# EAGLE design single_asic_miner (EAGLE 6.3)
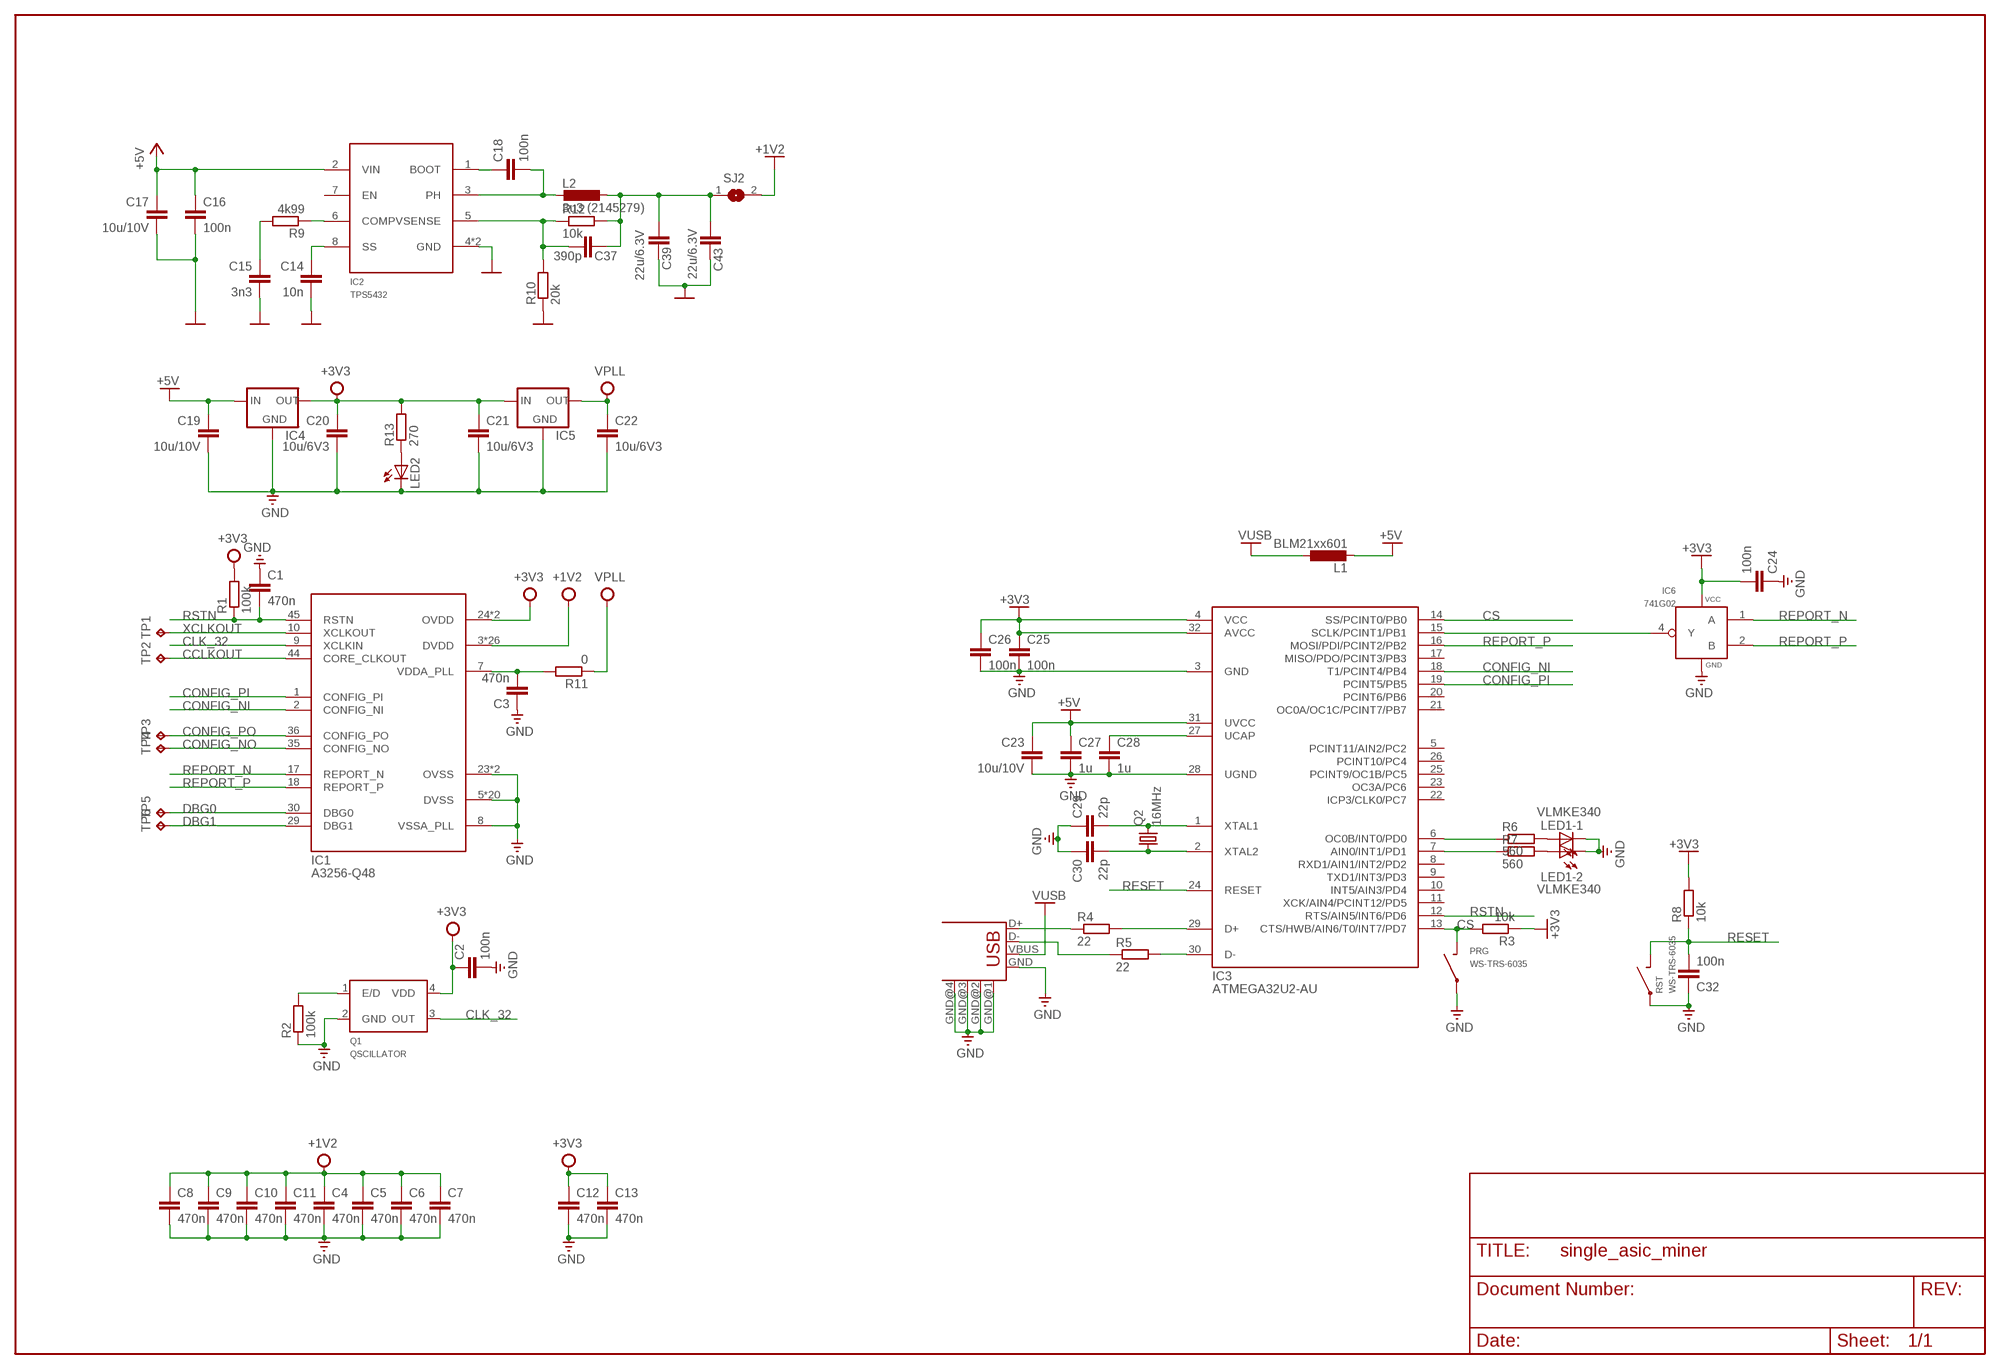
[diagram p0: schematic, sheet 1]

## Parts
C1  470n  C-EUC0805  [C0805]
C2  100n  C-EUC0805  [C0805]
C3  470n  C-EUC0805  [C0805]
C4  470n  C-EUC0805  [C0805]
C5  470n  C-EUC0805  [C0805]
C6  470n  C-EUC0805  [C0805]
C7  470n  C-EUC0805  [C0805]
C8  470n  C-EUC0805  [C0805]
C9  470n  C-EUC0805  [C0805]
C10  470n  C-EUC0805  [C0805]
C11  470n  C-EUC0805  [C0805]
C12  470n  C-EUC0805  [C0805]
C13  470n  C-EUC0805  [C0805]
C14  10n  C-EUC0805  [C0805]
C15  3n3  C-EUC0805  [C0805]
C16  100n  C-EUC0805  [C0805]
C17  10u/10V  C-EUC0805  [C0805]
C18  100n  C-EUC0805  [C0805]
C19  10u/10V  C-EUC0805  [C0805]
C20  10u/6V3  C-EUC0805  [C0805]
C21  10u/6V3  C-EUC0805  [C0805]
C22  10u/6V3  C-EUC0805  [C0805]
C23  10u/10V  C-EUC0805  [C0805]
C24  100n  C-EUC0805  [C0805]
C25  100n  C-EUC0805  [C0805]
C26  100n  C-EUC0805  [C0805]
C27  1u  C-EUC0805  [C0805]
C28  1u  C-EUC0805  [C0805]
C29  22p  C-EUC0805  [C0805]
C30  22p  C-EUC0805  [C0805]
C32  100n  C-EUC0805  [C0805]
C37  390p  C-EUC0805  [C0805]
C39  22u/6.3V  C-EUC0805  [C0805]
C43  22u/6.3V  C-EUC0805  [C0805]
IC1  A3256-Q48  [QFN48]
IC2  TPS5432  [SO08E]
IC3  ATMEGA32U2-AU  [TQFP32]
IC4  LM1117  [SOT223]
IC5  LM1117  [SOT223]
IC6  741G02  [SOT23-5]
L1  BLM21xx601  L-EUL0805  [L0805]
L2  3u3 (2145279)  L-4540  [L4540]
LED1  VLMKE340  VLMKE3400  [PLCC4]
LED2  LEDCHIP-LED0805  [CHIP-LED0805]
PRG  WS-TRS-6035  [WS-TRS]
Q1  QSCILLATOR  [SMD7552]
Q2  16MHz  CRYSTAL-ABM7  [6035]
R1  100k  R-EU_R0805  [R0805]
R2  100k  R-EU_R0805  [R0805]
R3  10k  R-EU_R0805  [R0805]
R4  22  R-EU_R0805  [R0805]
R5  22  R-EU_R0805  [R0805]
R6  560  R-EU_R0805  [R0805]
R7  560  R-EU_R0805  [R0805]
R8  10k  R-EU_R0805  [R0805]
R9  4k99  R-EU_R0805  [R0805]
R10  20k  R-EU_R0805  [R0805]
R11  0  R-EU_R0805  [R0805]
R12  10k  R-EU_R0805  [R0805]
R13  270  R-EU_R0805  [R0805]
RST  WS-TRS-6035  [WS-TRS]
SJ2  SJ  [SJ]
TP1  TPB1,27  [B1,27]
TP2  TPB1,27  [B1,27]
TP3  TPB1,27  [B1,27]
TP4  TPB1,27  [B1,27]
TP5  TPB1,27  [B1,27]
TP6  TPB1,27  [B1,27]
X1  USB-SHIELD-1  [USB-M-S1_1]

## Nets
+1V2: C4.1 C5.1 C6.1 C7.1 C8.1 C9.1 C10.1 C11.1 IC1.3(DVDD) IC1.4(DVDD) IC1.6(DVDD) IC1.11(DVDD) IC1.12(DVDD) IC1.13(DVDD) IC1.14(DVDD) IC1.15(DVDD) IC1.16(DVDD) IC1.19(DVDD) IC1.21(DVDD) IC1.22(DVDD) IC1.25(DVDD) IC1.26(DVDD) IC1.27(DVDD) IC1.28(DVDD) IC1.31(DVDD) IC1.33(DVDD) IC1.34(DVDD) IC1.39(DVDD) IC1.40(DVDD) IC1.41(DVDD) IC1.43(DVDD) IC1.46(DVDD) IC1.47(DVDD) IC1.48(DVDD) SJ2.2
+3V3: C2.1 C12.1 C13.1 C20.1 C21.1 C24.2 C25.1 C26.1 IC1.24(OVDD) IC1.37(OVDD) IC3.4(VCC) IC3.32(AVCC) IC4.2(OUT) IC5.3(IN) IC6.5(VCC) Q1.4(VDD) R1.2 R3.1 R8.2 R13.2
+5V: C16.1 C17.1 C19.1 C23.1 C27.1 IC2.2(VIN) IC3.31(UVCC) IC4.3(IN) L1.2
CCLKOUT: IC1.44(CORE_CLKOUT) TP2.TP
CLK_32: IC1.9(XCLKIN) Q1.3(OUT)
CONFIG_NI: IC1.2(CONFIG_NI) IC3.18(T1/PCINT4/PB4)
CONFIG_NO: IC1.35(CONFIG_NO) TP4.TP
CONFIG_PI: IC1.1(CONFIG_PI) IC3.19(PCINT5/PB5)
CONFIG_PO: IC1.36(CONFIG_PO) TP3.TP
CS: IC3.13(CTS/HWB/AIN6/T0/INT7/PD7) IC3.14(SS/PCINT0/PB0) PRG.P$2 R3.2
D+: IC3.29(D+) R4.2
D-: IC3.30(D-) R5.2
DBG0: IC1.30(DBG0) TP5.TP
DBG1: IC1.29(DBG1) TP6.TP
GND: C1.1 C2.2 C3.1 C4.2 C5.2 C6.2 C7.2 C8.2 C9.2 C10.2 C11.2 C12.2 C13.2 C14.2 C15.2 C16.2 C17.2 C19.2 C20.2 C21.2 C22.2 C23.2 C24.1 C25.2 C26.2 C27.2 C28.2 C29.1 C30.1 C32.1 C39.2 C43.2 IC1.5(DVSS) IC1.8(VSSA_PLL) IC1.20(DVSS) IC1.23(OVSS) IC1.32(DVSS) IC1.38(OVSS) IC1.42(DVSS) IC1.P$1(DVSS) IC1.P$2(DVSS) IC1.P$3(DVSS) IC1.P$4(DVSS) IC1.P$5(DVSS) IC1.P$6(DVSS) IC1.P$7(DVSS) IC1.P$8(DVSS) IC1.P$9(DVSS) IC1.P$10(DVSS) IC1.P$11(DVSS) IC1.P$12(DVSS) IC1.P$13(DVSS) IC1.P$14(DVSS) IC1.P$15(DVSS) IC1.P$16(DVSS) IC2.4(GND) IC2.E(GND) IC3.3(GND) IC3.28(UGND) IC4.1(GND) IC5.1(GND) IC6.3(GND) LED1.C1(-1:C) LED1.C2(-2:C) LED2.C PRG.P$1 Q1.2(GND) R2.1 R10.1 RST.P$1 X1.GND X1.GND@1(GND) X1.GND@2(GND) X1.GND@3(GND) X1.GND@4(GND)
N$1: IC3.15(SCLK/PCINT1/PB1) IC6.4(Y)
N$2: Q1.1(E/D) R2.2
N$3: IC3.6(OC0B/INT0/PD0) R6.1
N$4: IC3.7(AIN0/INT1/PD1) R7.1
N$5: LED1.A1(-1:A) R6.2
N$6: LED1.A2(-2:A) R7.2
N$7: C3.2 IC1.7(VDDA_PLL) R11.2
N$8: R4.1 X1.D+
N$9: R5.1 X1.D-
N$10: C28.1 IC3.27(UCAP)
N$11: LED2.A R13.1
N$13: C29.2 IC3.1(XTAL1) Q2.P$2
N$14: C30.2 IC3.2(XTAL2) Q2.P$1
N$23: C14.1 IC2.8(SS)
N$24: IC2.6(COMP) R9.1
N$25: C15.1 R9.2
N$26: C18.1 IC2.1(BOOT)
N$27: C18.2 IC2.3(PH) L2.P$2
N$28: C37.1 C39.1 C43.1 L2.P$1 R12.2 SJ2.1
N$29: C37.2 IC2.5(VSENSE) R10.2 R12.1
REPORT_N: IC1.17(REPORT_N) IC6.1(A)
REPORT_P: IC1.18(REPORT_P) IC3.16(MOSI/PDI/PCINT2/PB2) IC6.2(B)
RESET: C32.2 IC3.24(RESET) R8.1 RST.P$2
RSTN: C1.2 IC1.45(RSTN) IC3.12(RTS/AIN5/INT6/PD6) R1.1
VPLL: C22.1 IC5.2(OUT) R11.1
VUSB: L1.1 X1.VBUS
XCLKOUT: IC1.10(XCLKOUT) TP1.TP
Unconnected: IC2.7(EN) IC3.5(PCINT11/AIN2/PC2) IC3.8(RXD1/AIN1/INT2/PD2) IC3.9(TXD1/INT3/PD3) IC3.10(INT5/AIN3/PD4) IC3.11(XCK/AIN4/PCINT12/PD5) IC3.17(MISO/PDO/PCINT3/PB3) IC3.20(PCINT6/PB6) IC3.21(OC0A/OC1C/PCINT7/PB7) IC3.22(ICP3/CLK0/PC7) IC3.23(OC3A/PC6) IC3.25(PCINT9/OC1B/PC5) IC3.26(PCINT10/PC4)

## Library data of the parts
C1-C30 C32 C37 C39 C43 = rcl:C-EU: CAPACITOR, European symbol
IC1 = mystuff:A3256
IC2 = mystuff:TPS5432
IC3 = mystuff:ATMEGA32U2
IC4 IC5 = v-reg-2:LM1117
IC6 = mystuff:74*1G02
L1 = rcl:L-EU: INDUCTOR, European symbol
L2 = mystuff:L-
LED1 = mystuff:VLMKE340
LED2 = led:LED: LED OSRAM: - CHIPLED LG R971, LG N971, LY N971, LG Q971, LY Q971, LO R971, LY R971 LH N974, LH R974 LS Q976, LO Q976, LY Q976 LO Q996 - Hyper CHIPLED LW Q18S LB Q993, LB Q99A, LB R99A - SideLED LS A670, LO A670, LY A670, LG A670, LP A670 LB A673, LV A673, LT A673, LW A673 LH A674 LY A675 LS A676, LA A676, LO A676, LY A676, LW A676 LS A679, LY A679, LG A679 - Hyper Micro SIDELED® LS Y876, LA Y876, LO Y876, LY Y876 LT Y87S - SmartLED LW L88C, LW L88S LB L89C, LB L89S, LG L890 LS L89K, LO L89K, LY L89K LS L896, LA L896, LO L896, LY L896 - TOPLED LS T670, LO T670, LY T670, LG T670, LP T670 LSG T670, LSP T670, LSY T670, LOP T670, LYG T670 LG T671, LOG T671, LSG T671 LB T673, LV T673, LT T673, LW T673 LH T674 LS T676, LA T676, LO T676, LY T676, LB T676, LH T676, LSB T676, LW T676 LB T67C, LV T67C, LT T67C, LS T67K, LO T67K, LY T67K, LW E67C LS E67B, LA E67B, LO E67B, LY E67B, LB E67C, LV E67C, LT E67C LW T67C LS T679, LY T679, LG T679 LS T770, LO T770, LY T770, LG T770, LP T770 LB T773, LV T773, LT T773, LW T773 LH T774 LS E675, LA E675, LY E675, LS T675 LS T776, LA T776, LO T776, LY T776, LB T776 LHGB T686 LT T68C, LB T68C - Hyper Mini TOPLED® LB M676 - Mini TOPLED Santana® LG M470 LS M47K, LO M47K, LY M47K Source: http://www.osram.convergy.de LUXEON: - LUMILED® LXK2-PW12-R00, LXK2-PW12-S00, LXK2-PW14-U00, LXK2-PW14-V00 LXK2-PM12-R00, LXK2-PM12-S00, LXK2-PM14-U00 LXK2-PE12-Q00, LXK2-PE12-R00, LXK2-PE12-S00, LXK2-PE14-T00, LXK2-PE14-U00 LXK2-PB12-K00, LXK2-PB12-L00, LXK2-PB12-M00, LXK2-PB14-N00, LXK2-PB14-P00, LXK2-PB14-Q00 LXK2-PR12-L00, LXK2-PR12-M00, LXK2-PR14-Q00, LXK2-PR14-R00 LXK2-PD12-Q00, LXK2-PD12-R00, LXK2-PD12-S00 LXK2-PH12-R00, LXK2-PH12-S00 LXK2-PL12-P00, LXK2-PL12-Q00, LXK2-PL12-R00 Source: www.luxeon.com KINGBRIGHT: KA-3528ASYC Source: www.kingbright.com
PRG RST = mystuff:WS-TRS-6035
Q1 = mystuff:QSCILLATOR: Oscillators FOX Electronics FXO-HC736R-25
Q2 = mystuff:CRYSTAL-ABM7
R1-R13 = rcl:R-EU_: RESISTOR, European symbol
SJ2 = jumper:SJ: SMD solder JUMPER
TP1-TP6 = testpad:TP: Test pad
X1 = con-usb-2:USB-SHIELD

## Board
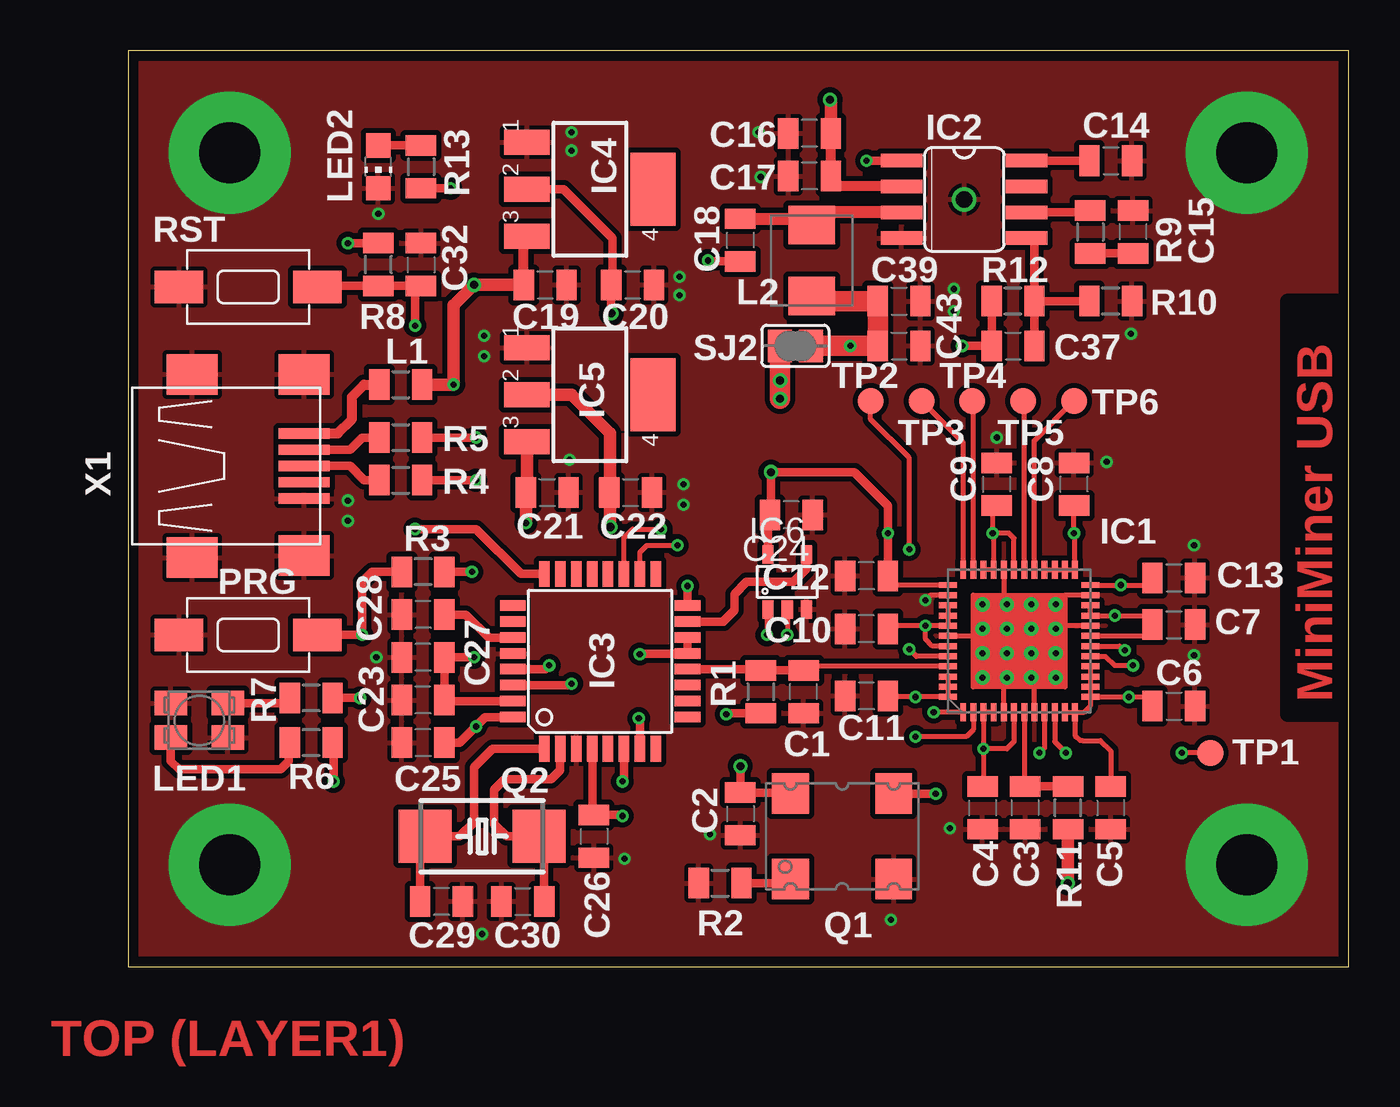
[diagram p1: board, top side]
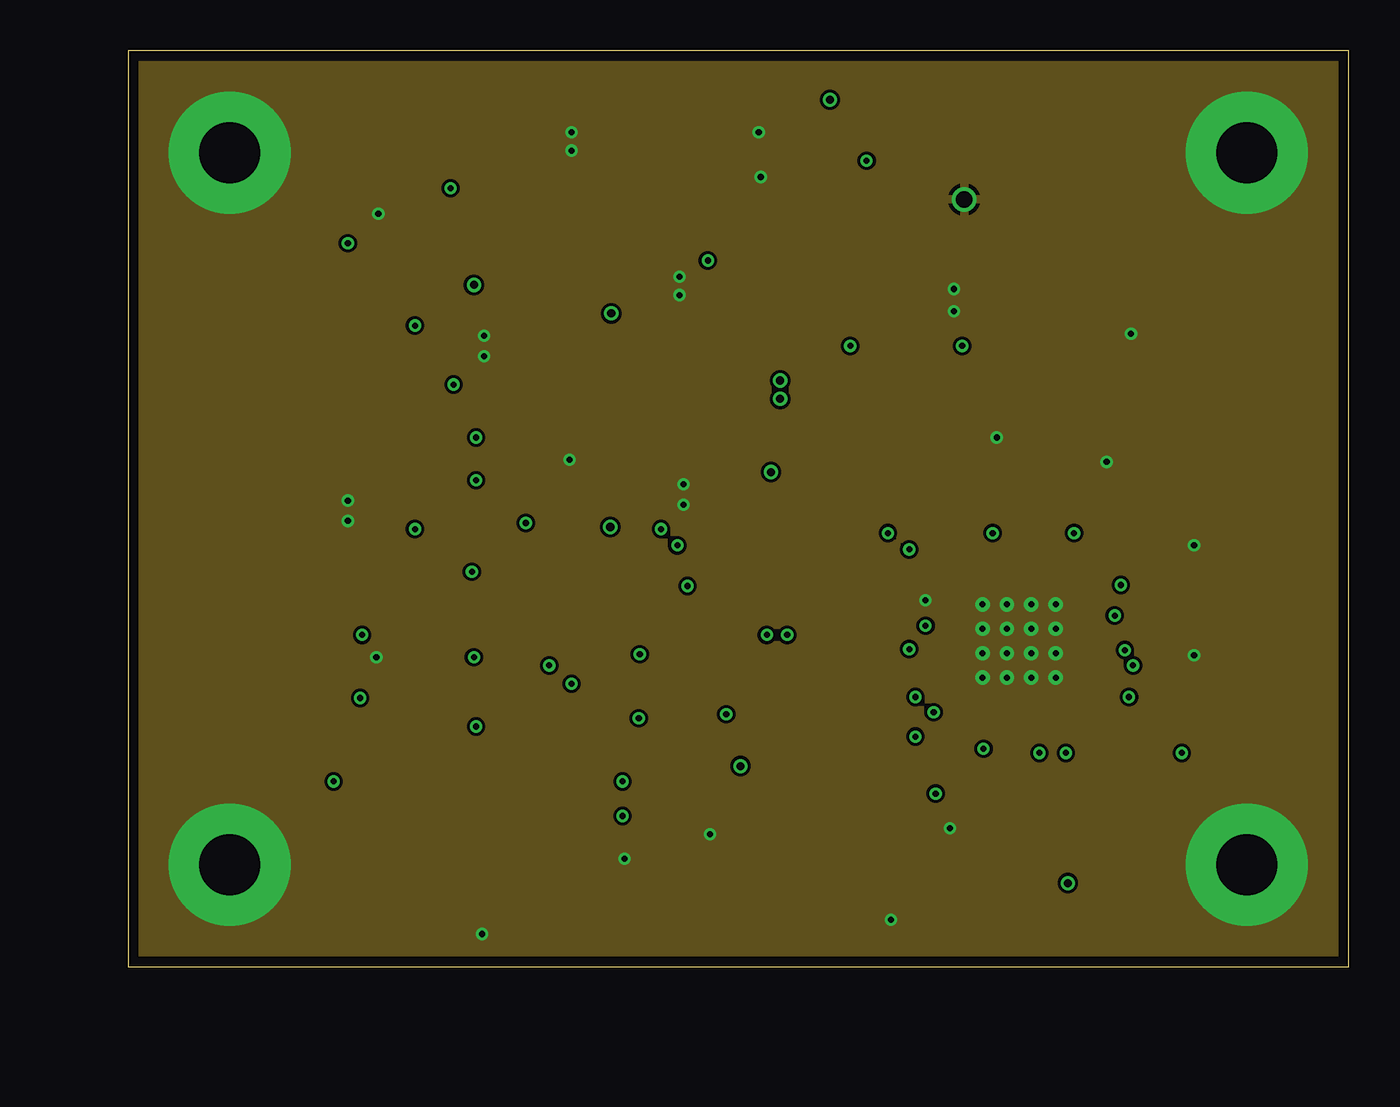
[diagram p2: board, inner layer Route2]
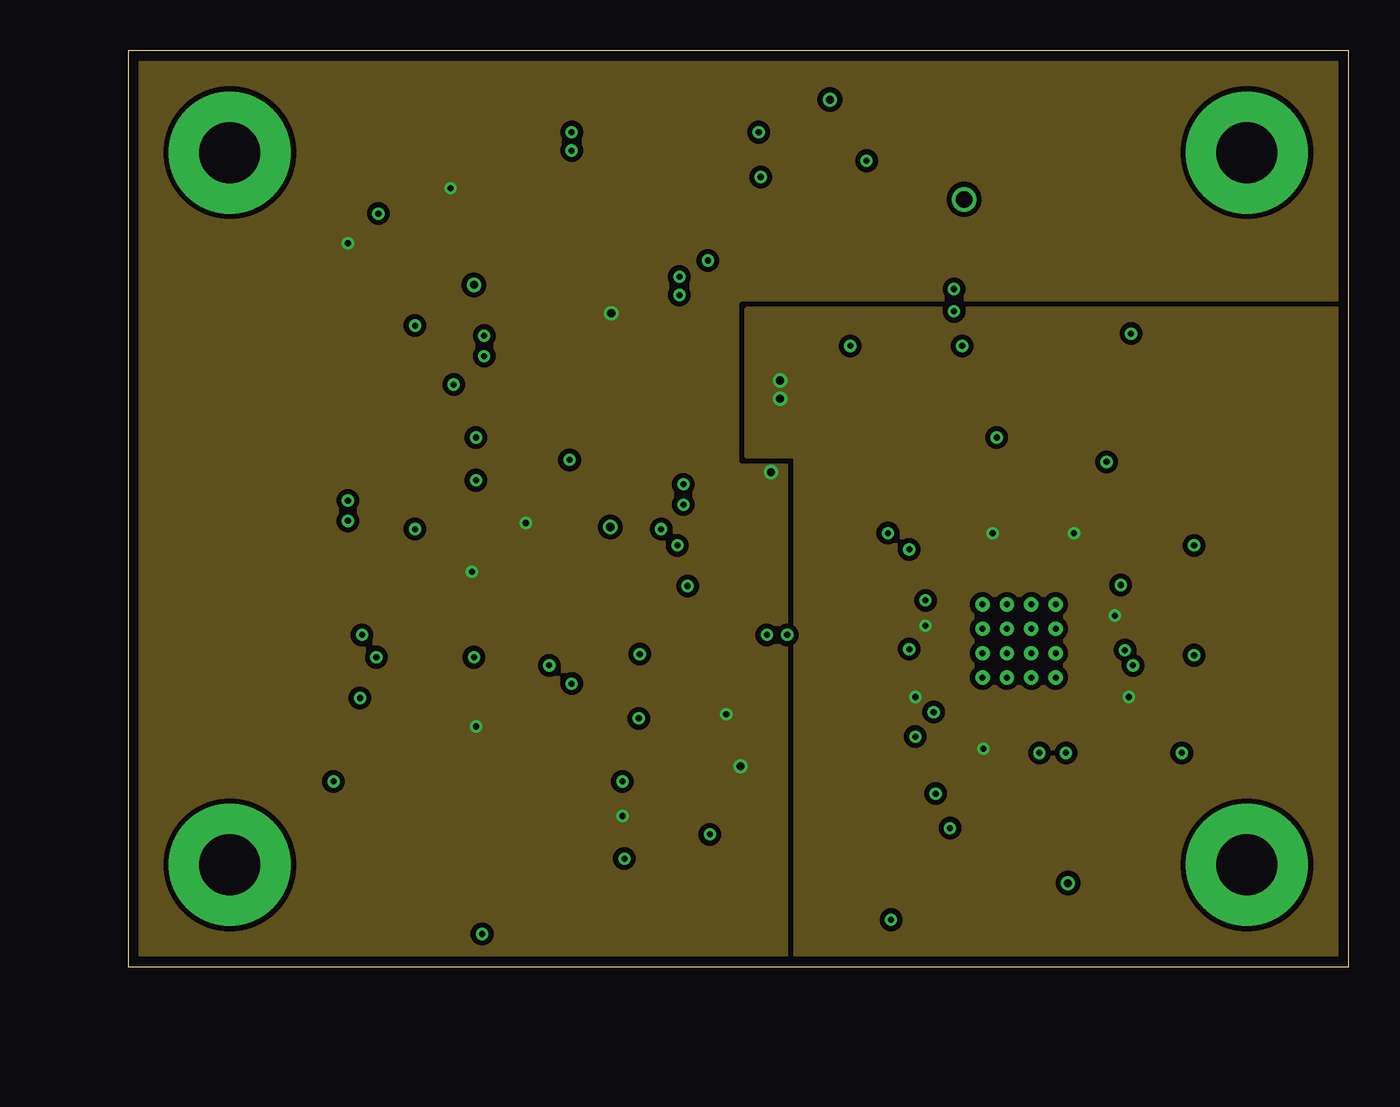
[diagram p3: board, inner layer Route15]
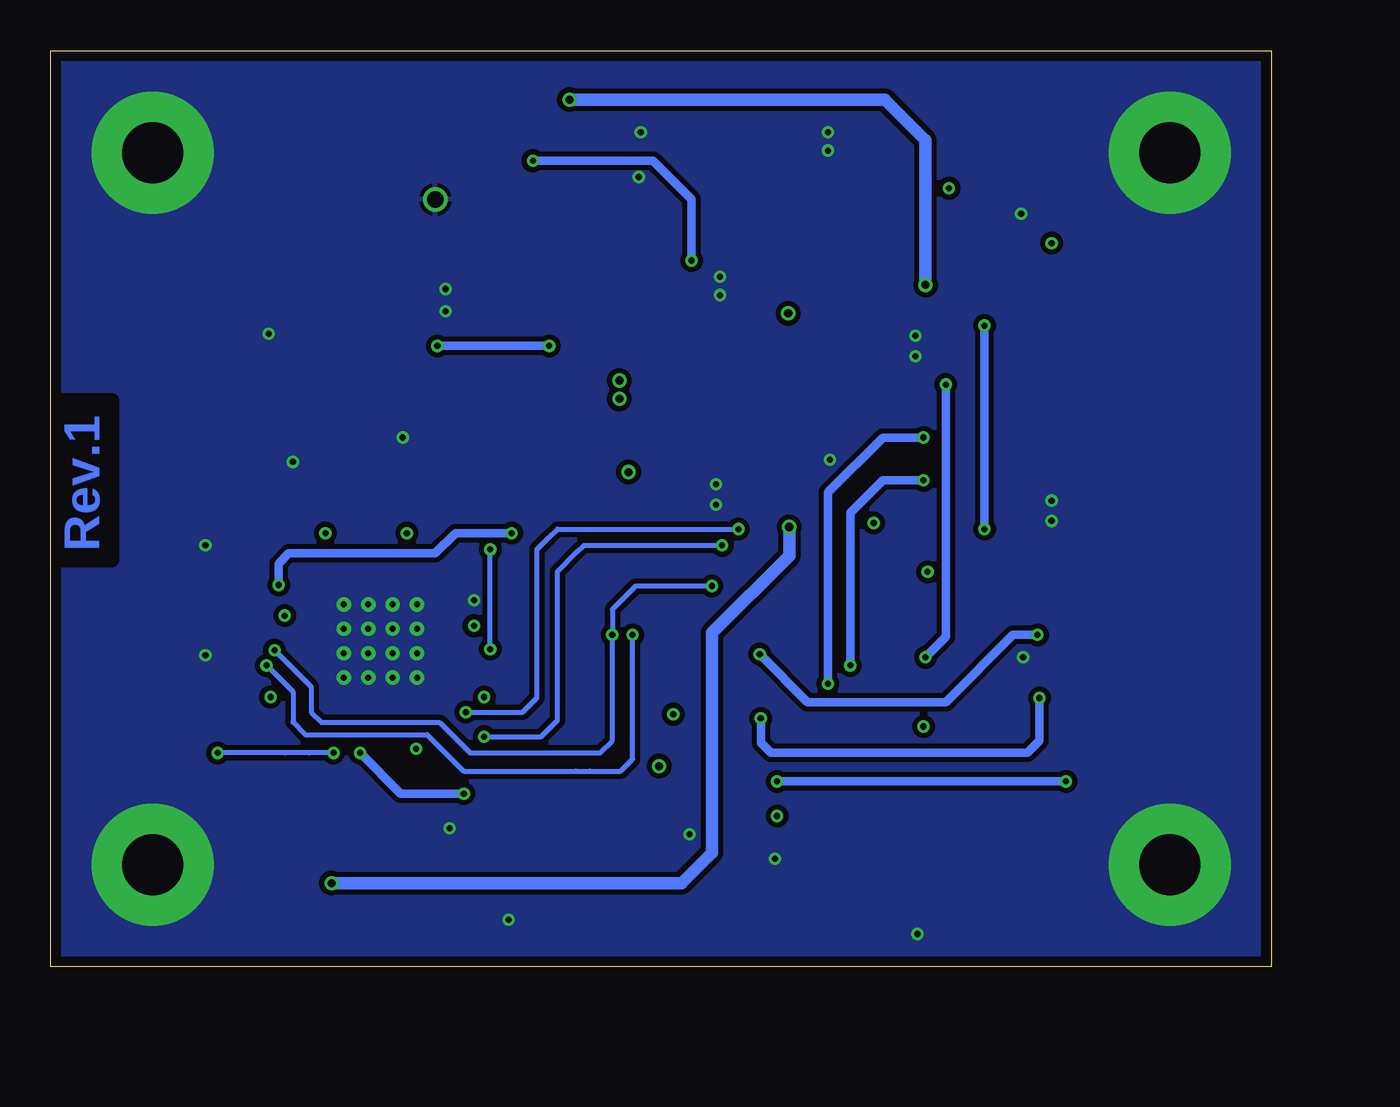
[diagram p4: board, bottom side, seen from below]

Size 60 x 45 mm. Coordinates in mm from the lower left corner, seen from the top.
Outline: 0,0 60,0 60,45 0,45 0,0
Copper layers (1+(2*15)+16): Top 0.035mm / dielectric 0.4mm / Route2 0.035mm / dielectric 0.7mm / Route15 0.035mm / dielectric 0.4mm / Bottom 0.035mm
Design rules "my_multi-cb_035um-cu *": minimum track width 0.15mm, minimum drill 0.3mm, track to track 0.15mm, track to pad 0.15mm, pad to pad 0.15mm, via to via 0.15mm, smd to smd 0.125mm, copper to edge 20mil, drill to drill 8mil, minimum pad ring 8mil, minimum via ring 0.15mm, stop-mask expansion 3mil, vias tented up to drill 0.2mm, thermal gap 8mil
tRestrict: 12 lines
bRestrict: 3 lines

### Footprints (pad centres in the part's own frame; a part is rotated, then mirrored left to right if it is on the bottom)
C0805 = smd 1 x 1.5: 1 -1.05,0; 2 1.05,0
QFN48 = smd 0.9 x 0.29: 1 -3.5,2.75; 2 -3.5,2.25; 3 -3.5,1.75; 4 -3.5,1.25; 5 -3.5,0.75; 6 -3.5,0.25; 7 -3.5,-0.25; 8 -3.5,-0.75; 9 -3.5,-1.25; 10 -3.5,-1.75; 11 -3.5,-2.25; 12 -3.5,-2.75; 25 3.5,-2.75; 26 3.5,-2.25; 27 3.5,-1.75; 28 3.5,-1.25; 29 3.5,-0.75; 30 3.5,-0.25; 31 3.5,0.25; 32 3.5,0.75; 33 3.5,1.25; 34 3.5,1.75; 35 3.5,2.25; 36 3.5,2.75 | smd 0.29 x 0.9: 13 -2.75,-3.5; 14 -2.25,-3.5; 15 -1.75,-3.5; 16 -1.25,-3.5; 17 -0.75,-3.5; 18 -0.25,-3.5; 19 0.25,-3.5; 20 0.75,-3.5; 21 1.25,-3.5; 22 1.75,-3.5; 23 2.25,-3.5; 24 2.75,-3.5; 37 2.75,3.5; 38 2.25,3.5; 39 1.75,3.5; 40 1.25,3.5; 41 0.75,3.5; 42 0.25,3.5; 43 -0.25,3.5; 44 -0.75,3.5; 45 -1.25,3.5; 46 -1.75,3.5; 47 -2.25,3.5; 48 -2.75,3.5 | drill 0.3: P$1 -1.8,0.6; P$2 1.8,1.8; P$3 -0.6,0.6; P$4 -1.8,-0.6; P$5 1.8,0.6; P$6 0.6,0.6; P$7 -1.8,1.8; P$8 -0.6,1.8; P$9 0.6,1.8; P$10 -0.6,-0.6; P$11 0.6,-0.6; P$12 1.8,-0.6; P$13 -1.8,-1.8; P$14 -0.6,-1.8; P$15 0.6,-1.8; P$16 1.8,-1.8
SO08E = smd 0.66 x 2.032: 1 -1.905,-3.073; 2 -0.635,-3.073; 3 0.635,-3.073; 4 1.905,-3.073; 5 1.905,3.073; 6 0.635,3.073; 7 -0.635,3.073; 8 -1.905,3.073 | drill 0.8: E 0,0
TQFP32 = smd 1.27 x 0.508: 1 -4.293,2.743; 2 -4.293,1.956; 3 -4.293,1.168; 4 -4.293,0.381; 5 -4.293,-0.381; 6 -4.293,-1.168; 7 -4.293,-1.956; 8 -4.293,-2.743; 17 4.293,-2.743; 18 4.293,-1.956; 19 4.293,-1.168; 20 4.293,-0.381; 21 4.293,0.381; 22 4.293,1.168; 23 4.293,1.956; 24 4.293,2.743 | smd 0.508 x 1.27: 9 -2.743,-4.293; 10 -1.956,-4.293; 11 -1.168,-4.293; 12 -0.381,-4.293; 13 0.381,-4.293; 14 1.168,-4.293; 15 1.956,-4.293; 16 2.743,-4.293; 25 2.743,4.293; 26 1.956,4.293; 27 1.168,4.293; 28 0.381,4.293; 29 -0.381,4.293; 30 -1.168,4.293; 31 -1.956,4.293; 32 -2.743,4.293
SOT223 = smd 1.219 x 2.235: 1 -2.311,-3.099; 2 0,-3.099; 3 2.311,-3.099 | smd 3.6 x 2.2: 4 0,3.099
SOT23-5 = smd 0.55 x 0.9: 1 -0.95,-1.35; 2 0,-1.35; 3 0.95,-1.35; 4 0.95,1.35; 5 -0.95,1.35
L0805 = smd 1 x 1.5: 1 -1.05,0; 2 1.05,0
L4540 = smd 2.3 x 1.9: P$1 0,1.75; P$2 0,-1.75
PLCC4 = smd 1.6 x 1.2: A1 1.4,0.85; A2 -1.4,-0.85; C1 -1.4,0.85; C2 1.4,-0.85
CHIP-LED0805 = smd 1.2 x 1.2: A 0,-1.05; C 0,1.05
WS-TRS = smd 2.4 x 1.6: P$1 -3.4,0; P$2 3.4,0
SMD7552 = smd 1.8 x 2: 1 -2.54,-2.1; 2 2.54,-2.1; 3 2.54,2.1; 4 -2.54,2.1
6035 = smd 2.6 x 2.6: P$1 -2.8,0; P$2 2.8,0
R0805 = smd 1 x 1.5: 1 -1.05,0; 2 1.05,0
SJ = smd 1.168 x 1.6: 1 -0.762,0; 2 0.762,0
B1,27 = smd 1.27 x 1.27: TP 0,0
USB-M-S1_1 = smd 2.5 x 0.5: D+ 2.75,0; D- 2.75,0.8; GND 2.75,-1.6; ID 2.75,-0.8; VBUS 2.75,1.6 | smd 2.5 x 2: GND@1 -2.75,-4.5; GND@2 -2.75,4.5; GND@3 2.75,-4.4; GND@4 2.75,4.5

### Placement (x,y rotation side)
C1  33.2,13.5 90 top
C2  30.1,7.5 270 top
C3  44.1,7.8 90 top
C4  42,7.8 270 top
C5  48.3,7.8 270 top
C6  51.4,12.8 0 top
C7  51.4,16.8 0 top
C8  46.5,23.7 90 top
C9  42.7,23.7 90 top
C10  36.3,16.6 180 top
C11  36.3,13.3 180 top
C12  36.3,19.2 180 top
C13  51.4,19.1 0 top
C14  48.3,39.6 0 top
C15  49.4,36.1 90 top
C16  33.5,40.95 180 top
C17  33.5,38.85 180 top
C18  30.1,35.7 90 top
C19  20.5,33.5 0 top
C20  24.8,33.5 0 top
C21  20.6,23.3 0 top
C22  24.7,23.3 0 top
C23  14.5,13.1 180 top
C24  32.6,22.2 180 top
C25  14.5,11 180 top
C26  22.9,6.4 270 top
C27  14.5,15.2 180 top
C28  14.5,17.3 180 top
C29  15.4,3.2 180 top
C30  19.4,3.2 0 top
C32  14.4,34.5 270 top
C37  43.5,30.5 0 top
C39  37.9,32.7 0 top
C43  37.9,30.5 0 top
IC1  43.8,16 90 top
IC2  41.1,37.7 270 top
IC3  23.2,15 90 top
IC4  22.7,38.2 270 top
IC5  22.7,28.1 270 top
IC6  32.4,18.9 0 top
L1  13.4,28.6 0 top
L2  33.6,34.7 180 top
LED1  3.5,12.1 180 top
LED2  12.3,39.3 180 top
PRG  5.9,16.3 0 top
Q1  35.1,6.4 0 top
Q2  17.4,6.4 180 top
R1  31.1,13.5 270 top
R2  29.1,4.1 0 top
R3  14.5,19.4 180 top
R4  13.4,23.9 0 top
R5  13.4,26 0 top
R6  9,11 180 top
R7  9,13.2 180 top
R8  12.3,34.5 90 top
R9  47.3,36.1 270 top
R10  48.3,32.7 180 top
R11  46.2,7.8 90 top
R12  43.5,32.7 180 top
R13  14.4,39.3 270 top
RST  5.9,33.4 0 top
SJ2  32.8,30.5 180 top
TP1  53.2,10.5 180 top
TP2  36.5,27.8 90 top
TP3  39,27.8 90 top
TP4  41.5,27.8 90 top
TP5  44,27.8 90 top
TP6  46.5,27.8 90 top
X1  5.9,24.6 0 top

### Tracks (layer width: path | path; a pad name or v marks a point on that pad's centre or on a via)
+1V2  (via drill 0.3, 0.4)
  Top 0.254: C8.1 v46.5,21.3 46.55,21.25 IC1.25 IC1.26 IC1.27 IC1.28 | C5.1 48.3,10.6 47.8,11.1 46.9,11.1 46.8,11.1 46.6,11.3 46.55,11.35 IC1.12 | IC1.11 IC1.12 | IC1.16 IC1.15 IC1.14 IC1.13 | IC1.12 47,12.5 47.3,12.8 IC1.13 | IC1.22 IC1.21 48.45,17.25 v48.5,17.25 50.35,17.25 C7.1 50.35,16.25 IC1.19 | v42.5,21.3 42.5,22.3 42.5,22.45 C9.1 | IC1.34 IC1.33 42.55,21.25 v42.5,21.3 | IC1.46 IC1.47 IC1.48 v38.7,13.25 37.4,13.25 C11.1 | 50.35,13.25 C6.1 50.35,13.25 | v42.05,10.7 IC1.3 IC1.4 | v42.05,10.7 42.05,8.9 C4.1 41.95,8.8 | IC1.6 43.55,11.05 43.2,10.7 v42.05,10.7 | IC1.31 43.55,21.05 43.3,21.3 v42.5,21.3 | v39.2,16.75 IC1.41 IC1.40 IC1.39 | v39.2,16.75 37.5,16.75 C10.1 | IC1.13 v49.2,13.25 50.35,13.25 | IC1.43 39.55,15.75 39.2,16.1 v39.2,16.75
  Top 1: v32.05,27.9 v32.05,28.8 32.05,30.49 SJ2.2
  pour Route15 (isolate 0.254): 32.8,-1.7 62.3,-1.7 62.3,32.3 30.4,32.3 30.4,25.1 32.8,25.1
+3V3  (via drill 0.3, 0.4)
  Top 0.254: IC1.24 v48.8,18.75 50.35,18.75 C13.1 | IC1.37 37.35,18.75 C12.1
  Top 0.406: IC3.32 17.56,12.26 v17.1,11.8 16.3,11 C25.1 | IC3.4 22.82,7.53 C26.1 24.25,7.45 v24.3,7.4 | 19.6,23.35 C21.1 | R1.2 29.45,12.45 v29.4,12.4 | 37.35,18.75 37.35,20.85 v37.35,21.3 37.35,22.65 35.7,24.3 v31.6,24.3 31.6,22.25 C24.2 31.45,22.1 IC6.5 | R13.2 v15.85,38.25 | Q1.4 32.56,8.55 C2.1 v30.1,9.85 | IC4.2 21.4,38.2 23.8,35.8 23.8,33.55 C20.1 v23.75,32.1 | R3.1 v16.9,19.4 | R8.2 v10.8,35.55
  Top 0.61: C21.1 v19.55,21.8 | IC5.3 19.6,23.35
  Bottom 0.406: v37.35,21.3 40.1,21.3 41.1,20.3 48.3,20.3 48.8,19.8 v48.8,18.75
  pour Route15 (isolate 0.254, rank 6): -17.3,60.4 79.6,60.4 79.6,-16.3 -17.3,-16.3
+5V  (via drill 0.3, 0.4)
  Top 0.406: IC3.31 15.61,13.04 C23.1 C27.1 v17,15.2 | 34.55,38.34 C17.1 | 19.45,35.74 IC4.3
  Top 0.5: C17.1 C16.1 | IC2.2 34.55,38.34 | C19.1 19.45,35.74
  Top 0.61: L1.2 v16,28.6 16,32.5 v17,33.5 C19.1 | C16.1 34.55,42.55 v34.5,42.6
  Bottom 0.406: v16,28.6 16,16.2 v17,15.2
  Bottom 0.61: v34.5,42.6 28.4,42.6 19,42.6 17,40.6 v17,33.5
CCLKOUT  (via drill 0.3)
  Top 0.254: IC1.44 38.75,15.25 v38.4,15.6 | v38.4,20.5 38.4,25 36.5,26.9 TP2.TP
  Bottom 0.254: v38.4,15.6 v38.4,20.5
CLK_32  (via drill 0.3)
  Top 0.254: IC1.9 45.05,10.75 v44.8,10.5
  Top 0.406: Q1.3 v39.7,8.5
  Bottom 0.406: v39.7,8.5 42.8,8.5 v44.8,10.5
CONFIG_NI  (via drill 0.3)
  Top 0.254: IC1.2 41.55,11.65 41.2,11.3 v38.7,11.3 | IC3.18 25.16,20.36 25.5,20.7 v27,20.7
  Bottom 0.254: v38.7,11.3 35.9,11.3 35.1,12.1 35.1,19.4 34.1,20.4 33.8,20.7 v27,20.7
CONFIG_NO
  Top 0.254: IC1.35 41.55,27.75 TP4.TP
CONFIG_PI  (via drill 0.3)
  Top 0.254: IC1.1 v39.6,12.5 | IC3.19 24.37,21.07 24.8,21.5 v26.2,21.5
  Bottom 0.254: v39.6,12.5 36.8,12.5 36.1,13.2 36.1,20.5 35.5,21.1 35.1,21.5 v26.2,21.5
CONFIG_PO
  Top 0.254: IC1.36 41.05,25.75 TP3.TP
CS  (via drill 0.3)
  Top 0.406: v25.15,15.35 25.18,15.38 IC3.13 IC3.14 | PRG.P$2 v11.5,16.3 11.5,18.9 12,19.4 R3.2
  Bottom 0.406: v11.5,16.3 12.7,16.3 16,13 22.8,13 v25.15,15.35
D+  (via drill 0.3)
  Top 0.406: R4.2 v17.1,23.9 | IC3.29 20.52,14.62 v20.7,14.8
  Bottom 0.406: v17.1,23.9 19.1,23.9 20.7,22.3 v20.7,14.8
D-  (via drill 0.3)
  Top 0.406: IC3.30 21.73,13.83 v21.8,13.9 | v17.1,26 R5.2
  Bottom 0.406: v21.8,13.9 21.8,23.3 19.1,26 v17.1,26
DBG0
  Top 0.254: IC1.30 44.05,27.75 TP5.TP
DBG1
  Top 0.254: IC1.29 44.55,25.85 TP6.TP
GND  (via drill 0.3, 3 pad 6)
  Top 0.254: IC1.38 39.45,18.25 v39.2,18 | IC1.42 41.65,16.25 IC1.P$9 | IC1.23 46.05,18.25 IC1.P$16 | IC1.20 45.75,16.75 IC1.P$15 | IC1.8 44.55,14.05 IC1.P$4 | IC1.5 43.05,14.05 IC1.P$1 | IC1.32 43.05,17.95 IC1.P$5
  other vias: 5,5 5,40 55,5 55,40 28.6,6.5 24.4,5.3 17.4,1.6 12.2,15.2 27.3,23.7 27.3,22.7 21.7,24.9 17.5,31 17.5,30 10.8,22.9 10.8,21.9 12.3,37 27.1,33.9 27.1,33 21.8,41 21.8,40.1 31,41 31.1,38.8 40.6,33.3 40.6,32.2 49.3,31.1 48.1,24.8 42.7,26 52.4,20.7 52.4,15.3 40.4,6.8 37.5,2.3
  pour Route2: -11.4,54.5 73.3,54.5 73.3,-10.5 -11.4,-10.5
  pour Top (isolate 0.254): -5,49 67,49 67,-5 -5,-5
  pour Bottom (isolate 0.254): -23,67 87,67 87,-24 -23,-24
N$1
  Top 0.406: IC6.4 33.35,19.55 32.7,18.9 30.4,18.9 29.8,18.3 29.8,17.5 29.3,17 29.26,16.96 IC3.15
N$2
  Top 0.406: R2.2 32.56,4.1 Q1.1
N$3  (via drill 0.3)
  Top 0.406: IC3.6 24.37,9.17 v24.3,9.1 | v10.1,9.1 10.1,10.95 R6.1
  Bottom 0.406: v24.3,9.1 v10.1,9.1
N$4  (via drill 0.3)
  Top 0.406: IC3.7 25.16,12.14 v25.1,12.2 | v11.4,13.2 R7.1
  Bottom 0.406: v25.1,12.2 25.1,11 24.6,10.5 12,10.5 11.4,11.1 v11.4,13.2
N$5
  Top 0.406: LED1.A1 2.1,10.3 2.1,10.1 2.5,9.7 2.7,9.7 7.5,9.7 7.9,10.1 7.9,10.95 R6.2
N$6
  Top 0.406: LED1.A2 7.7,12.95 R7.2
N$7
  Top 0.254: IC1.7 44.05,8.9 C3.2
  Top 0.406: C3.2 R11.2
N$8
  Top 0.406: X1.D+ 10.9,24.6 11.6,23.9 R4.1
N$9
  Top 0.406: X1.D- 10.9,25.4 11.5,26 R5.1
N$10
  Top 0.406: IC3.27 17.73,16.17 16.6,17.3 C28.1
N$11
  Top 0.406: LED2.A R13.1
N$13
  Top 0.406: IC3.1 17.91,10.71 17,9.8 17,7.1 16.3,6.4 Q2.P$2 14.35,6.15 C29.2
N$14
  Top 0.406: IC3.2 21.24,9.64 20.8,9.2 18.5,9.2 18,8.7 18,7 18.6,6.4 Q2.P$1 20.45,6.15 C30.2
N$23
  Top 0.406: IC2.8 C14.1
N$24
  Top 0.406: IC2.6 47.22,37.06 R9.1
N$25
  Top 0.406: R9.2 C15.1
N$26  (via drill 0.3)
  Top 0.406: C18.1 28.55,34.65 v28.5,34.7 | v36.3,39.6 IC2.1
  Bottom 0.406: v28.5,34.7 28.5,37.7 30.4,39.6 v36.3,39.6
N$27
  Top 0.406: 33.6,37.06 L2.P$2 33.6,36.75
  Top 0.6: IC2.3 33.6,37.06 | C18.2 33.6,36.75
N$28  (via drill 0.3)
  Top 0.406: 33.6,32.7 L2.P$1 | v41,30.5 C37.1 R12.2
  Top 1: 33.6,32.7 C39.1 C43.1 v35.5,30.5 SJ2.1
  Bottom 0.406: v41,30.5 v35.5,30.5
N$29
  Top 0.406: R12.1 C37.2 | R12.1 R10.2 | R12.1 44.55,35.8 IC2.5
REPORT_N  (via drill 0.3)
  Top 0.254: IC1.17 48.05,15.25 48.5,14.8 v49.4,14.8 | IC6.1 31.4,17.55 v31.4,16.3
  Bottom 0.254: v49.4,14.8 48.1,13.5 48.1,12 47.5,11.4 41.5,11.4 39.7,9.6 34.2,9.6 33.5,9.6 32,9.6 31.4,10.2 v31.4,16.3
REPORT_P  (via drill 0.3)
  Top 0.254: IC1.18 48.75,15.75 48.8,15.7 48.9,15.6 48.95,15.55 v49,15.55 | IC6.2 v32.4,16.3
  Top 0.406: IC3.16 v27.49,18.69 v27.5,18.7
  Bottom 0.254: v49,15.55 48.5,15.05 47.2,13.75 47.2,12.5 46.7,12 40.9,12 39.4,10.5 34.9,10.5 33.9,10.5 33,10.5 32.4,11.1 v32.4,16.3 IC6.2 31.25,18.7 v27.5,18.7
RESET  (via drill 0.3)
  Top 0.406: 13.9,33.45 R8.1 9.35,33.45 RST.P$2 | 13.9,33.45 C32.2 | IC3.24 19.31,19.29 17.1,21.5 v14.1,21.5 | v14.1,31.5 14.1,33.25 13.9,33.45
  Bottom 0.406: v14.1,21.5 v14.1,31.5
RSTN
  Top 0.254: IC1.45 33.4,14.75 C1.2
  Top 0.406: C1.2 R1.1 31.03,14.62 IC3.12
VPLL  (via drill 0.4)
  Top 0.406: 23.7,23.35 C22.1
  Top 0.61: IC5.2 21.8,28.1 23.7,26.2 23.7,23.35 v23.7,21.6 | v46.2,4.1 R11.1
  Bottom 0.61: v23.7,21.6 23.7,20.2 27.5,16.4 27.5,5.6 29,4.1 v46.2,4.1
VUSB
  Top 0.5: X1.VBUS 10.3,26.2 11,26.9 11,28 11.6,28.6 L1.1
XCLKOUT  (via drill 0.3)
  Top 0.254: TP1.TP v51.8,10.5 | IC1.10 45.55,11.05 v46.1,10.5
  Bottom 0.254: v46.1,10.5 47.3,10.5 48.5,10.5 v51.8,10.5

### Text on the board
Top: MiniMiner USB | TOP (LAYER1)
Route2: GND (LAYER 2)
Route15: VCC (LAYER 3)
Bottom: Rev.1 | BOTTOM (LAYER4)